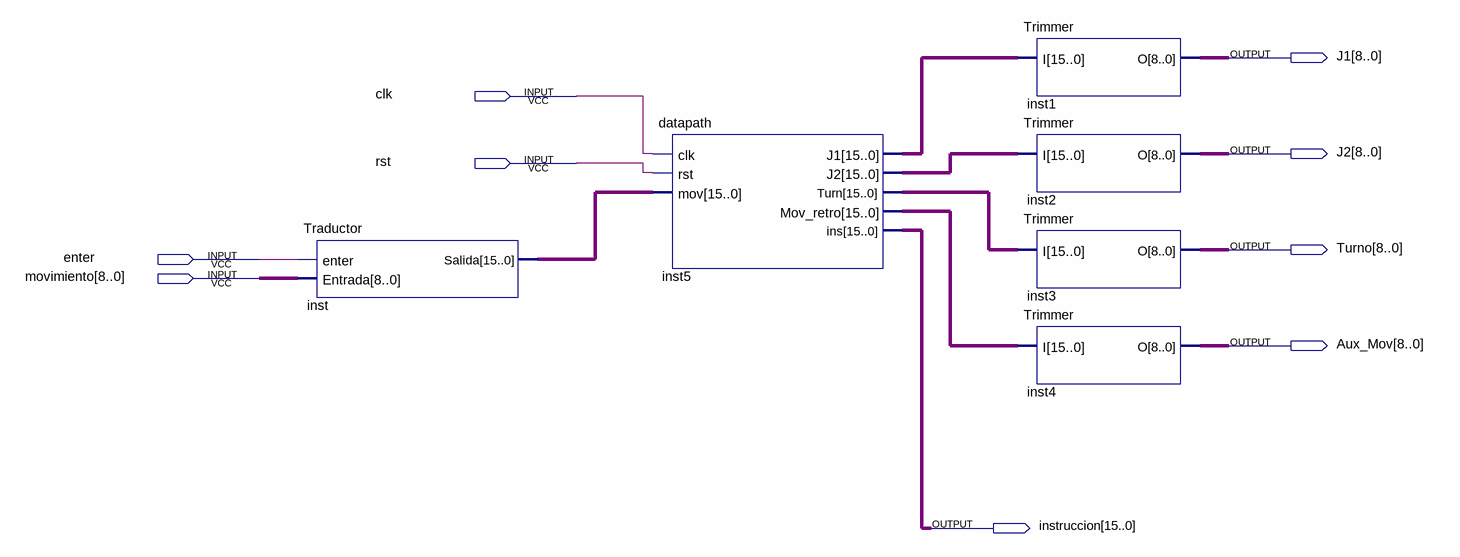
[diagram p0: schematic sheet]
// Quartus schematic practica3.bdf as structural Verilog: 6 symbols, 9 pins
module practica3 (
  input  clk,
  input  rst,
  input  enter,
  input  [8:0] movimiento,
  output [8:0] J1,
  output [8:0] J2,
  output [8:0] Turno,
  output [8:0] Aux_Mov,
  output [15:0] instruccion
);

  wire [15:0] inst5_j1, inst5_j2, inst5_mov_retro, inst5_turn, inst_salida;

  Traductor inst (.enter(enter), .Entrada(movimiento), .Salida(inst_salida));
  datapath inst5 (
    .clk(clk), .rst(rst), .mov(inst_salida), .J1(inst5_j1), .J2(inst5_j2), .Turn(inst5_turn),
    .Mov_retro(inst5_mov_retro), .ins(instruccion));
  Trimmer inst1 (.I(inst5_j1), .O(J1));
  Trimmer inst2 (.I(inst5_j2), .O(J2));
  Trimmer inst3 (.I(inst5_turn), .O(Turno));
  Trimmer inst4 (.I(inst5_mov_retro), .O(Aux_Mov));
endmodule
